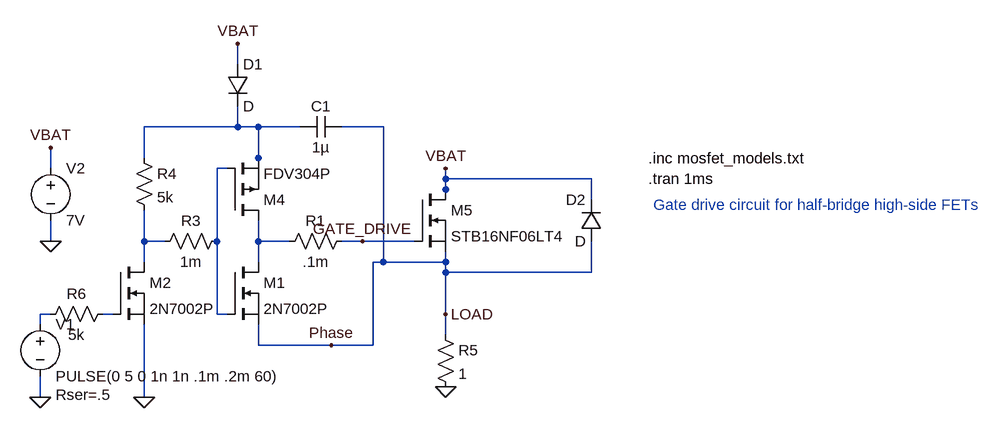
[diagram p0: schematic h_bridge_high_side.asc]
h_bridge_high_side.asc, the LTspice schematic file:
Version 4
SHEET 1 880 680
WIRE -432 -1040 -432 -1072
WIRE -432 -944 -432 -976
WIRE -432 -944 -576 -944
WIRE -400 -944 -432 -944
WIRE -336 -944 -400 -944
WIRE -208 -944 -272 -944
WIRE -576 -896 -576 -944
WIRE -400 -896 -400 -944
WIRE -720 -880 -720 -912
WIRE -448 -880 -464 -880
WIRE -400 -880 -400 -896
WIRE -112 -864 -112 -880
WIRE 112 -864 -112 -864
WIRE -112 -848 -112 -864
WIRE -112 -832 -112 -848
WIRE 112 -832 112 -864
WIRE -720 -768 -720 -800
WIRE -576 -768 -576 -816
WIRE -544 -768 -576 -768
WIRE -464 -768 -464 -880
WIRE -400 -768 -400 -800
WIRE -352 -768 -400 -768
WIRE -240 -768 -272 -768
WIRE -160 -768 -240 -768
WIRE -576 -736 -576 -768
WIRE -400 -736 -400 -768
WIRE -208 -736 -208 -944
WIRE -208 -736 -224 -736
WIRE -112 -736 -112 -752
WIRE -112 -736 -208 -736
WIRE -112 -720 -112 -736
WIRE 112 -720 112 -768
WIRE 112 -720 -112 -720
WIRE -720 -656 -736 -656
WIRE -624 -656 -640 -656
WIRE -464 -656 -464 -768
WIRE -448 -656 -464 -656
WIRE -112 -656 -112 -720
WIRE -736 -640 -736 -656
WIRE -112 -624 -112 -656
WIRE -400 -608 -400 -640
WIRE -288 -608 -400 -608
WIRE -224 -608 -224 -736
WIRE -224 -608 -288 -608
WIRE -736 -528 -736 -560
WIRE -576 -528 -576 -640
FLAG -736 -528 0
FLAG -576 -528 0
FLAG -112 -880 VBAT
FLAG -112 -656 LOAD
FLAG -240 -768 GATE_DRIVE
FLAG -720 -912 VBAT
FLAG -720 -768 0
FLAG -112 -544 0
FLAG -432 -1072 VBAT
FLAG -288 -608 Phase
SYMBOL res -256 -784 R90
WINDOW 0 0 56 VBottom 2
WINDOW 3 32 56 VTop 2
SYMATTR InstName R1
SYMATTR Value .1m
SYMBOL nmos -448 -736 R0
SYMATTR InstName M1
SYMATTR Value 2N7002P
SYMATTR Prefix X
SYMBOL res -448 -784 R90
WINDOW 0 0 56 VBottom 2
WINDOW 3 32 56 VTop 2
SYMATTR InstName R3
SYMATTR Value 1m
SYMBOL nmos -624 -736 R0
SYMATTR InstName M2
SYMATTR Value 2N7002P
SYMATTR Prefix X
SYMBOL voltage -736 -656 R0
WINDOW 123 0 0 Left 2
WINDOW 39 24 124 Left 2
SYMATTR SpiceLine Rser=.5
SYMATTR InstName V1
SYMATTR Value PULSE(0 5 0 1n 1n .1m .2m 60)
SYMBOL res -592 -912 R0
SYMATTR InstName R4
SYMATTR Value 5k
SYMBOL res -624 -672 R90
WINDOW 0 0 56 VBottom 2
WINDOW 3 32 56 VTop 2
SYMATTR InstName R6
SYMATTR Value 5k
SYMBOL voltage -720 -896 R0
WINDOW 123 0 0 Left 2
WINDOW 39 0 0 Left 2
SYMATTR InstName V2
SYMATTR Value 7V
SYMBOL pmos -448 -800 M180
SYMATTR InstName M4
SYMATTR Value FDV304P
SYMATTR Prefix X
SYMBOL nmos -160 -848 R0
SYMATTR InstName M5
SYMATTR Value STB16NF06LT4
SYMATTR Prefix X
SYMBOL res -128 -640 R0
SYMATTR InstName R5
SYMATTR Value 1
SYMBOL diode 128 -768 R180
WINDOW 0 24 64 Left 2
WINDOW 3 24 0 Left 2
SYMATTR InstName D2
SYMBOL diode -448 -1040 R0
SYMATTR InstName D1
SYMBOL cap -272 -960 R90
WINDOW 0 0 32 VBottom 2
WINDOW 3 32 32 VTop 2
SYMATTR InstName C1
SYMATTR Value 1µ
TEXT 200 -896 Left 2 !.inc mosfet_models.txt
TEXT 200 -864 Left 2 !.tran 1ms
TEXT 208 -824 Left 2 ;Gate drive circuit for half-bridge high-side FETs

The netlist it stands for:
* h_bridge_high_side.asc
R1 GATE_DRIVE N004 .1m
XM1 N004 N002 Phase 2N7002P  ; pins D G S
R3 N002 N003 1m
XM2 N003 N006 0 2N7002P  ; pins D G S
V1 N005 0 PULSE(0 5 0 1n 1n .1m .2m 60) Rser=.5
R4 N001 N003 5k
R6 N006 N005 5k
V2 VBAT 0 7V
XM4 N004 N002 N001 FDV304P  ; pins D G S
XM5 VBAT GATE_DRIVE Phase STB16NF06LT4  ; pins D G S
R5 Phase 0 1
D2 Phase VBAT D
D1 VBAT N001 D
C1 Phase N001 1µ
.model D D
.lib standard.dio
.inc mosfet_models.txt
.tran 1ms
* Gate drive circuit for half-bridge high-side FETs
.backanno
.end